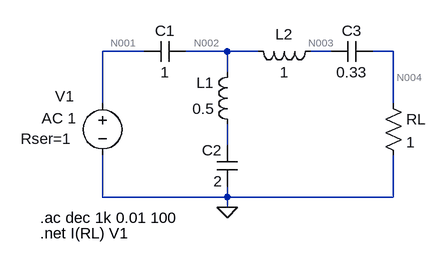
[diagram p0: schematic ej1_d.asc]
ej1_d.asc, the LTspice schematic file:
Version 4
SHEET 1 880 680
WIRE 80 64 16 64
WIRE 208 64 144 64
WIRE 256 64 208 64
WIRE 368 64 336 64
WIRE 464 64 432 64
WIRE 208 96 208 64
WIRE 16 144 16 64
WIRE 464 144 464 64
WIRE 208 208 208 176
WIRE 16 288 16 224
WIRE 208 288 208 272
WIRE 208 288 16 288
WIRE 464 288 464 224
WIRE 464 288 208 288
WIRE 208 304 208 288
FLAG 208 304 0
SYMBOL voltage 16 128 R0
WINDOW 0 -73 5 Left 2
WINDOW 123 -94 39 Left 2
WINDOW 39 -126 70 Left 2
SYMATTR InstName V1
SYMATTR Value ""
SYMATTR Value2 AC 1
SYMATTR SpiceLine Rser=1
SYMBOL cap 80 80 R270
WINDOW 0 32 32 VTop 2
WINDOW 3 0 32 VBottom 2
SYMATTR InstName C1
SYMATTR Value 1
SYMBOL cap 224 272 R180
WINDOW 0 24 56 Left 2
WINDOW 3 24 8 Left 2
SYMATTR InstName C2
SYMATTR Value 2
SYMBOL res 448 128 R0
SYMATTR InstName RL
SYMATTR Value 1
SYMBOL ind 224 192 R180
WINDOW 0 36 80 Left 2
WINDOW 3 36 40 Left 2
SYMATTR InstName L1
SYMATTR Value 0.5
SYMBOL ind 352 48 R90
WINDOW 0 5 56 VBottom 2
WINDOW 3 32 56 VTop 2
SYMATTR InstName L2
SYMATTR Value 1
SYMBOL cap 432 48 R90
WINDOW 0 0 32 VBottom 2
WINDOW 3 32 32 VTop 2
SYMATTR InstName C3
SYMATTR Value 0.33
TEXT -80 320 Left 2 !.ac dec 1k 0.01 100
TEXT -80 344 Left 2 !.net I(RL) V1

The netlist it stands for:
* ej1_d.asc
V1 N001 0 AC 1 Rser=1
C1 N001 N002 1
C2 0 N005 2
RL N004 0 1
L1 N005 N002 0.5
L2 N003 N002 1
C3 N004 N003 0.33
.ac dec 1k 0.01 100
.net I(RL) V1
.backanno
.end

* Results of the author's LTspice run, read from the files saved beside the schematic
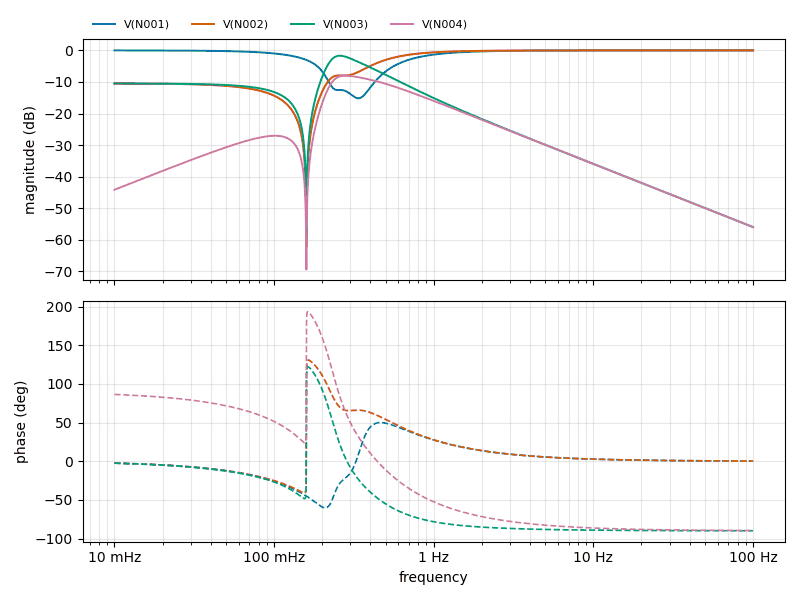
[diagram p1: AC Analysis of ej1_d.asc, plotted from the saved traces]
* AC Analysis, 1 run:
*   V(N001): -0.01 dB at 10 mHz, -0.00 dB at 100 Hz, peak -0.00 dB at 100 Hz, 3 dB below the peak at 693.4 mHz
*   V(N002): -10.48 dB at 10 mHz, -0.00 dB at 100 Hz, peak -0.00 dB at 100 Hz, 3 dB below the peak at 499 mHz
*   V(N003): -10.47 dB at 10 mHz, -55.96 dB at 100 Hz, peak -1.68 dB at 257.6 mHz, 3 dB below the peak at 216.4 mHz and 373.9 mHz
*   V(N004): -44.14 dB at 10 mHz, -55.96 dB at 100 Hz, peak -7.99 dB at 278.6 mHz, 3 dB below the peak at 224.2 mHz and 531.5 mHz